# Altium schematic sheet 13_FLOW_Sensor.SchDoc
size 420 x 297 mm; SheetNumber: 20; SheetTotal: 29
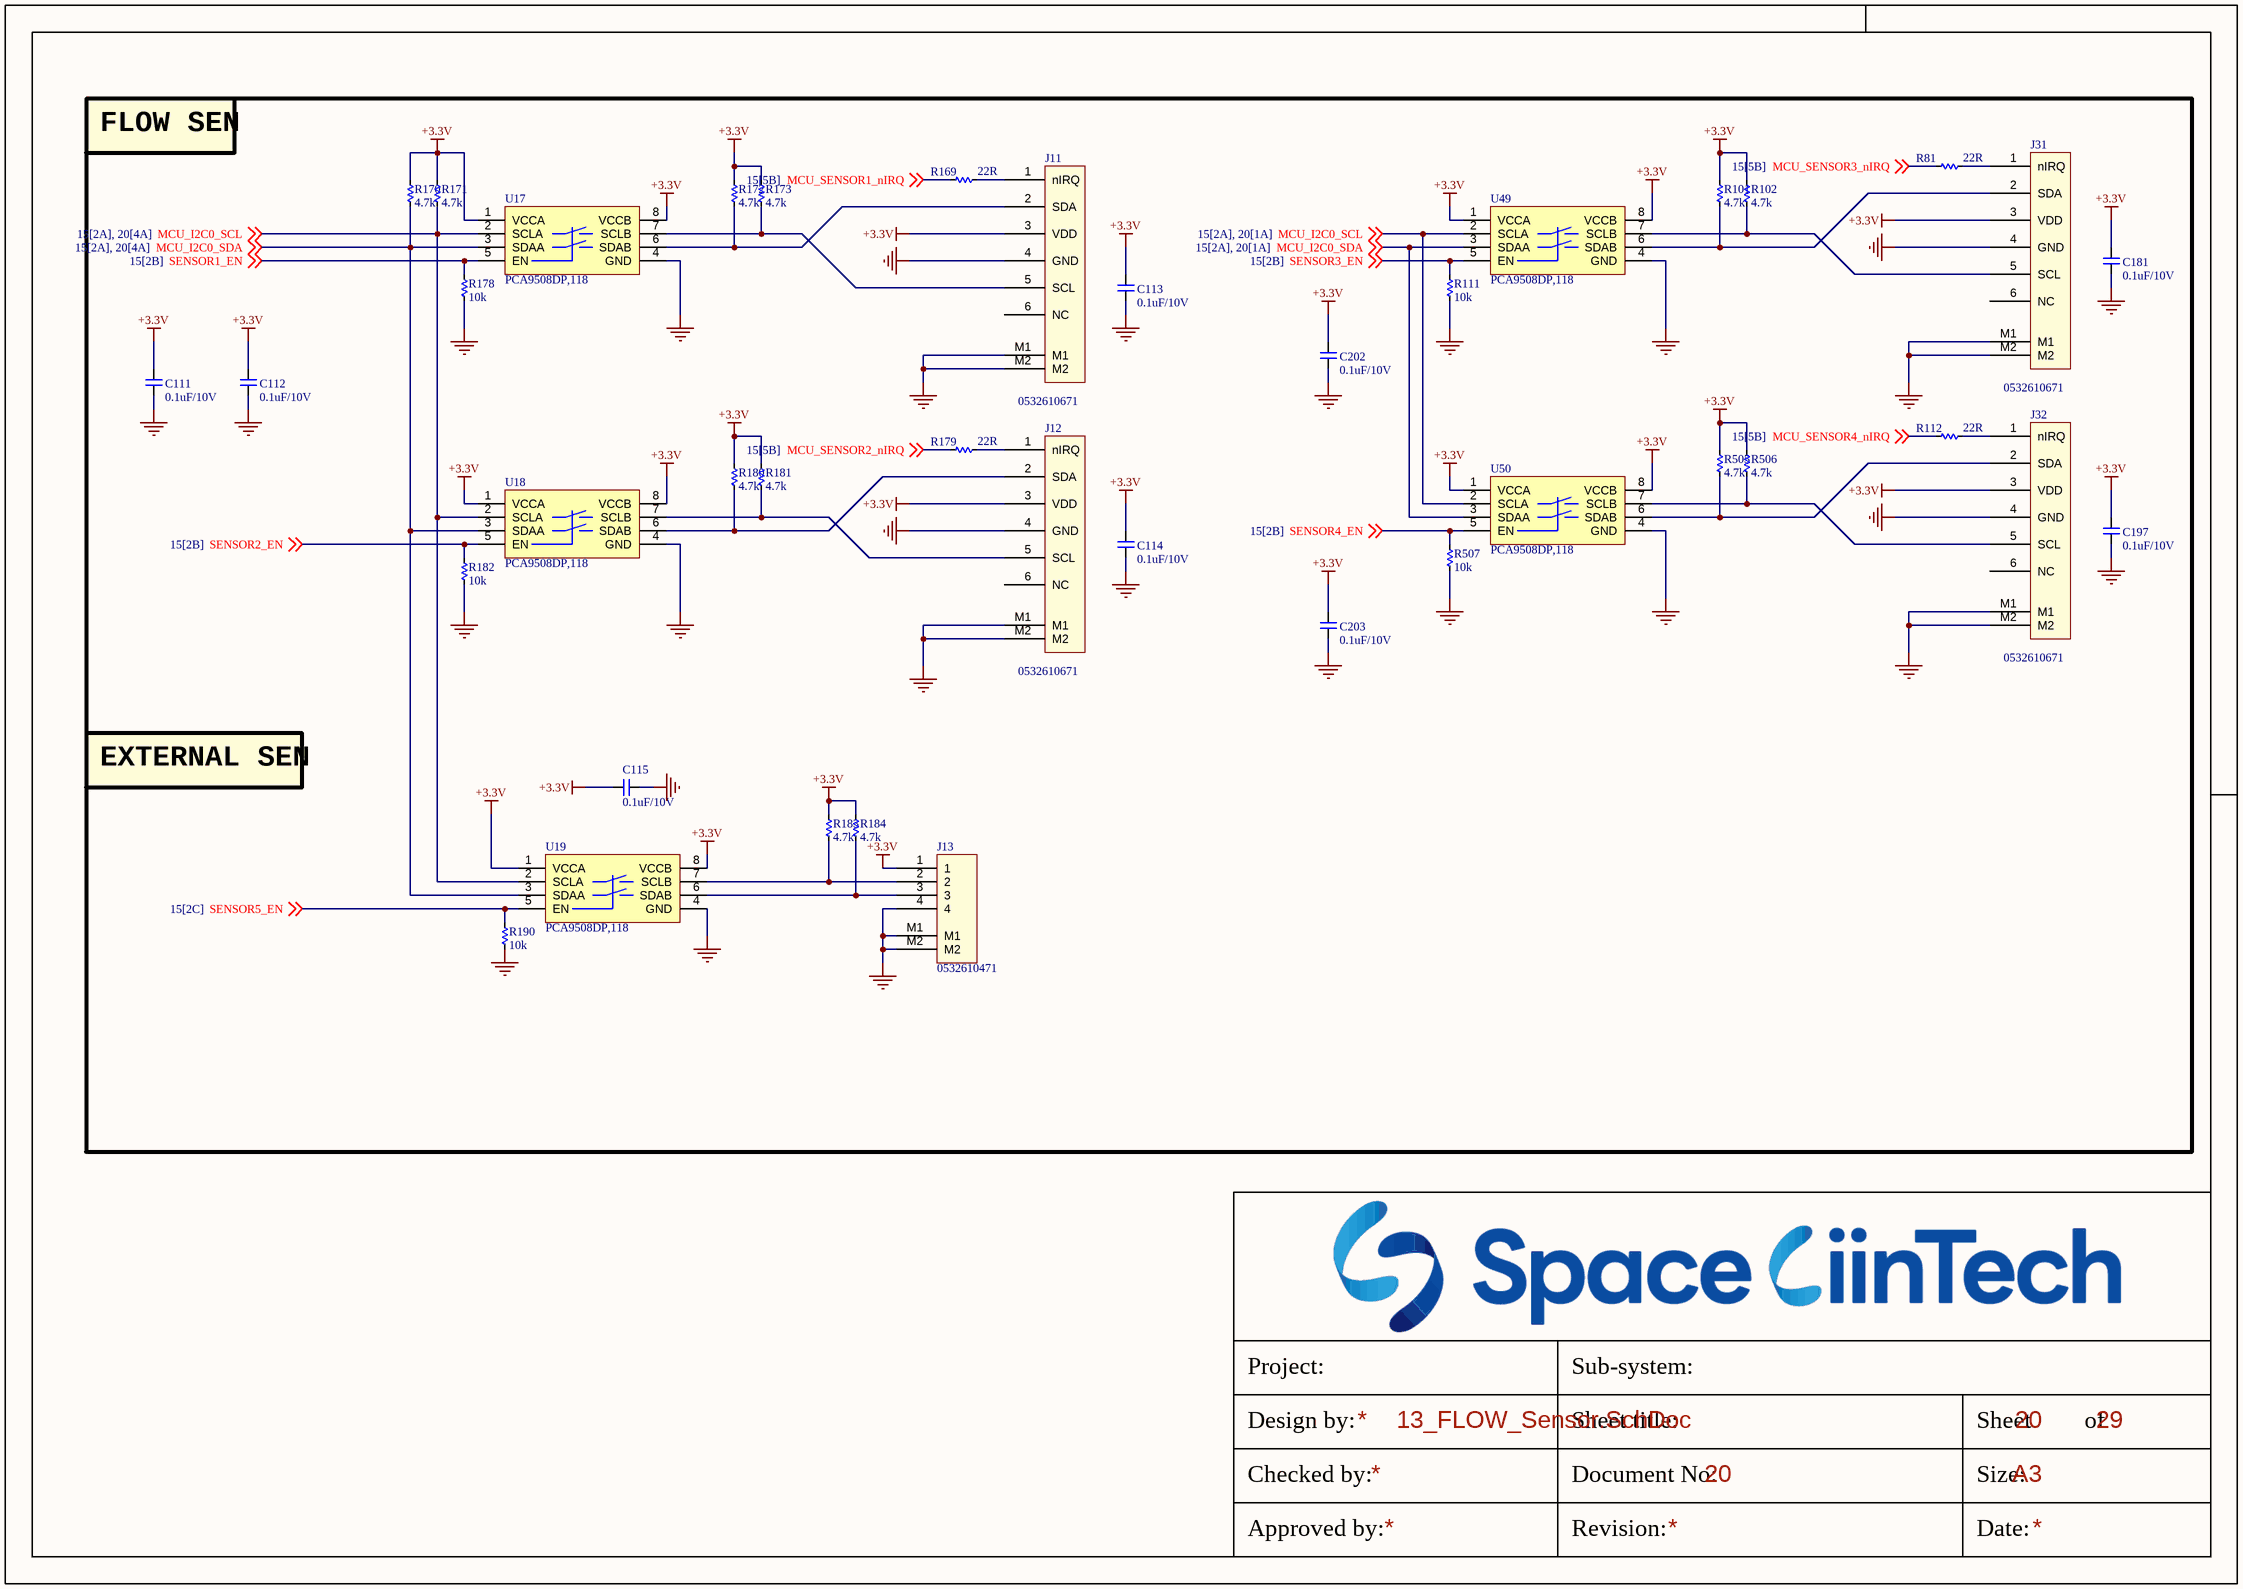
[diagram p0: 13_FLOW_Sensor.SchDoc]

## Parts
C111  0.1uF/10V  [CAP_C_1005X60]
C112  0.1uF/10V  [CAP_C_1005X60]
C113  0.1uF/10V  [CAP_C_1005X60]
C114  0.1uF/10V  [CAP_C_1005X60]
C115  0.1uF/10V  [CAP_C_1005X60]
C181  0.1uF/10V  [CAP_C_1005X60]
C197  0.1uF/10V  [CAP_C_1005X60]
C202  0.1uF/10V  [CAP_C_1005X60]
C203  0.1uF/10V  [CAP_C_1005X60]
J11  0532610671  [MOLEX_0532610671]
J12  0532610671  [MOLEX_0532610671]
J13  0532610471  [MOLEX_0532610471]
J31  0532610671  [MOLEX_0532610671]
J32  0532610671  [MOLEX_0532610671]
R81  22R  [RES_C_1005X40]
R101  4.7k  [RES_C_1005X40]
R102  4.7k  [RES_C_1005X40]
R111  10k  [RES_C_1005X40]
R112  22R  [RES_C_1005X40]
R169  22R  [RES_C_1005X40]
R170  4.7k  [RES_C_1005X40]
R171  4.7k  [RES_C_1005X40]
R172  4.7k  [RES_C_1005X40]
R173  4.7k  [RES_C_1005X40]
R178  10k  [RES_C_1005X40]
R179  22R  [RES_C_1005X40]
R180  4.7k  [RES_C_1005X40]
R181  4.7k  [RES_C_1005X40]
R182  10k  [RES_C_1005X40]
R183  4.7k  [RES_C_1005X40]
R184  4.7k  [RES_C_1005X40]
R190  10k  [RES_C_1005X40]
R505  4.7k  [RES_C_1005X40]
R506  4.7k  [RES_C_1005X40]
R507  10k  [RES_C_1005X40]
U17  PCA9508DP,118  [TSOP8]
U18  PCA9508DP,118  [TSOP8]
U19  PCA9508DP,118  [TSOP8]
U49  PCA9508DP,118  [TSOP8]
U50  PCA9508DP,118  [TSOP8]

## Nets
+3.3V: C111.2 C112.2 C113.2 C114.2 C115.2 C181.2 C197.2 C202.2 C203.2 J11.3(VDD) J12.3(VDD) J13.1 J31.3(VDD) J32.3(VDD) R101.1 R102.1 R170.1 R171.1 R172.1 R173.1 R180.1 R181.1 R183.1 R184.1 R505.1 R506.1 U17.1(VCCA) U17.8(VCCB) U18.1(VCCA) U18.8(VCCB) U19.1(VCCA) U19.8(VCCB) U49.1(VCCA) U49.8(VCCB) U50.1(VCCA) U50.8(VCCB)
GND: C111.1 C112.1 C113.1 C114.1 C115.1 C181.1 C197.1 C202.1 C203.1 J11.4(GND) J11.M1 J11.M2 J12.4(GND) J12.M1 J12.M2 J13.4 J13.M1 J13.M2 J31.4(GND) J31.M1 J31.M2 J32.4(GND) J32.M1 J32.M2 R111.2 R178.2 R182.2 R190.2 R507.2 U17.4(GND) U18.4(GND) U19.4(GND) U49.4(GND) U50.4(GND)
MCU_I2C0_SCL: R171.2 U17.2(SCLA) U18.2(SCLA) U19.2(SCLA) U49.2(SCLA) U50.2(SCLA) ; off-sheet MCU_I2C0_SCL
MCU_I2C0_SDA: R170.2 U17.3(SDAA) U18.3(SDAA) U19.3(SDAA) U49.3(SDAA) U50.3(SDAA) ; off-sheet MCU_I2C0_SDA
MCU_SENSOR1_nIRQ: R169.2 ; off-sheet MCU_SENSOR1_nIRQ
MCU_SENSOR2_nIRQ: R179.2 ; off-sheet MCU_SENSOR2_nIRQ
MCU_SENSOR3_nIRQ: R81.2 ; off-sheet MCU_SENSOR3_nIRQ
MCU_SENSOR4_nIRQ: R112.2 ; off-sheet MCU_SENSOR4_nIRQ
SENSOR1_EN: R178.1 U17.5(EN) ; off-sheet SENSOR1_EN
SENSOR2_EN: R182.1 U18.5(EN) ; off-sheet SENSOR2_EN
SENSOR3_EN: R111.1 U49.5(EN) ; off-sheet SENSOR3_EN
SENSOR4_EN: R507.1 U50.5(EN) ; off-sheet SENSOR4_EN
SENSOR5_EN: R190.1 U19.5(EN) ; off-sheet SENSOR5_EN
NetJ11_1: J11.1(nIRQ) R169.1
NetJ11_2: J11.2(SDA) R172.2 U17.6(SDAB)
NetJ11_5: J11.5(SCL) R173.2 U17.7(SCLB)
NetJ12_1: J12.1(nIRQ) R179.1
NetJ12_2: J12.2(SDA) R180.2 U18.6(SDAB)
NetJ12_5: J12.5(SCL) R181.2 U18.7(SCLB)
NetJ13_2: J13.2 R183.2 U19.7(SCLB)
NetJ13_3: J13.3 R184.2 U19.6(SDAB)
NetJ31_1: J31.1(nIRQ) R81.1
NetJ31_2: J31.2(SDA) R101.2 U49.6(SDAB)
NetJ31_5: J31.5(SCL) R102.2 U49.7(SCLB)
NetJ32_1: J32.1(nIRQ) R112.1
NetJ32_2: J32.2(SDA) R505.2 U50.6(SDAB)
NetJ32_5: J32.5(SCL) R506.2 U50.7(SCLB)

Not connected (* = marked no-connect by the designer): J11 6(NC); J12 6(NC); J31 6(NC); J32 6(NC)

## Notes on the sheet
- FLOW SEN
- EXTERNAL SEN
- Project:
- Sub-system:
- Design by:
- Sheet title:
- Sheet
- of
- Checked by:
- Approved by:
- Revision:
- Document No:
- Size:
- Date:
- A3

## Library data of the parts
C111-C115 C181 C197 C202 C203 = _CAP_C_2: CAP CHIP
J11 J12 J31 J32 = FLOW_SENSOR
J13 = Header 4x1_2M
R81 R101 R102 R111 R112 R169-R173 R178-R184 R190 R505-R507 = _RES_B_2: RES